# EAGLE schematic detector04 (EAGLE 6.1)
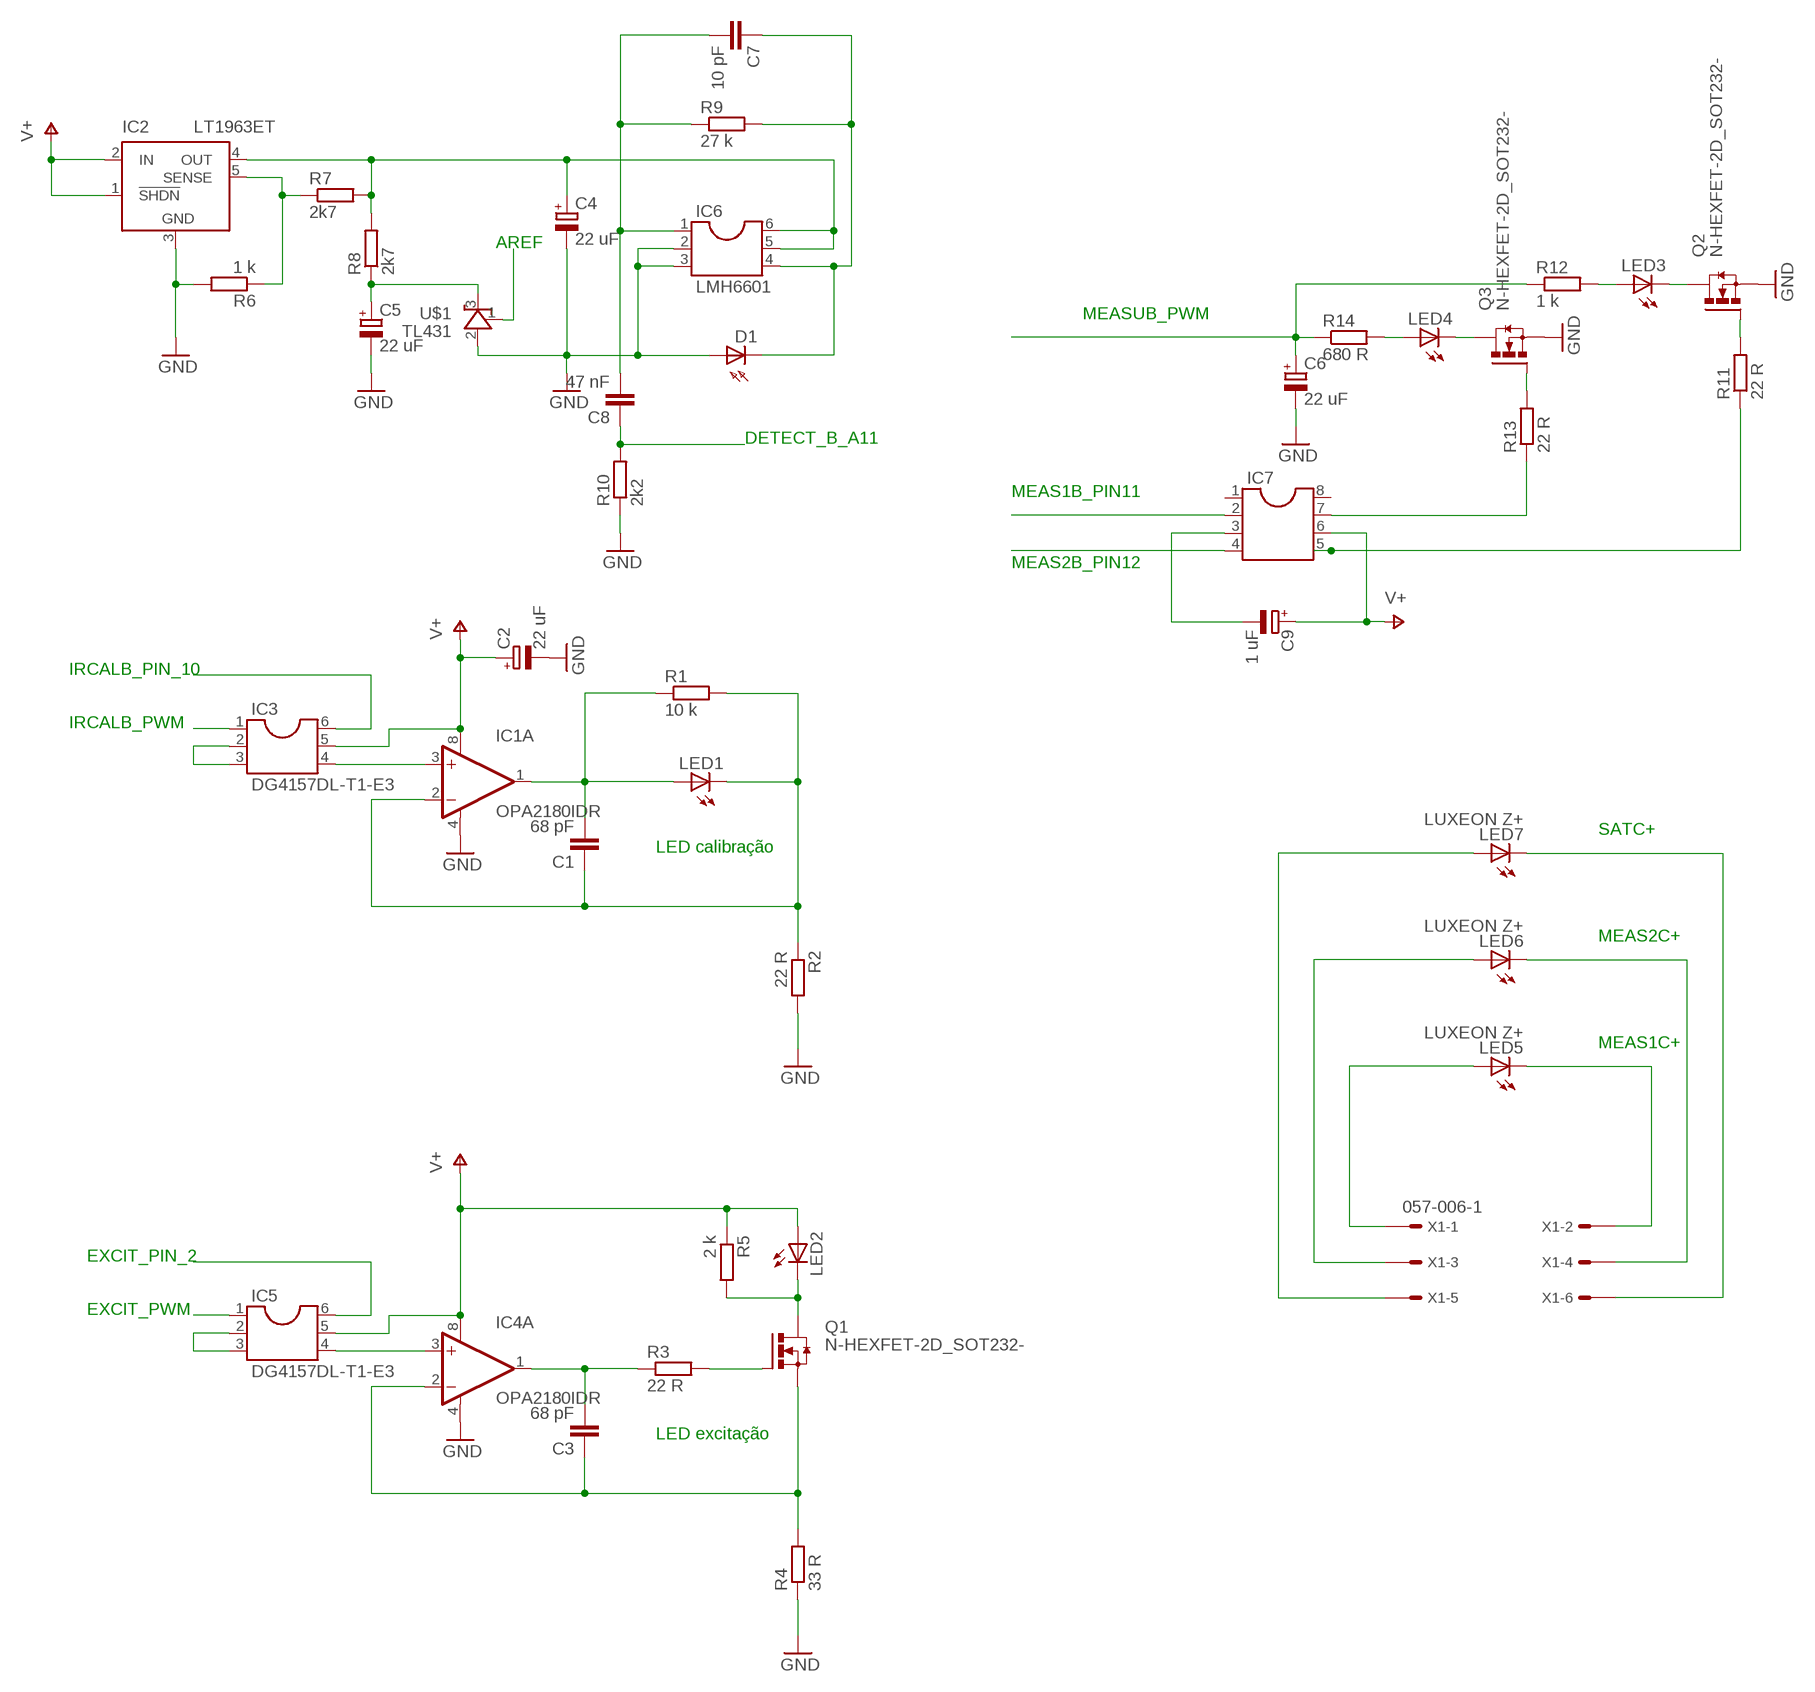
[diagram p0: schematic, sheet 1]

## Parts
C1  68 pF  C-EU025-040X050  [C025-040X050]
C2  22 uF  CPOL-EUE2.5-5  [E2,5-5]
C3  68 pF  C-EU025-040X050  [C025-040X050]
C4  22 uF  CPOL-EUE2.5-5  [E2,5-5]
C5  22 uF  CPOL-EUE2.5-5  [E2,5-5]
C6  22 uF  CPOL-EUE2.5-5  [E2,5-5]
C7  10 pF  C-EU025-040X050  [C025-040X050]
C8  47 nF  C-EU025-040X050  [C025-040X050]
C9  1 uF  CPOL-EUE2.5-5  [E2,5-5]
D1  BPW32  [BPW32]
IC1  OPA2180IDR  OPA2132P  [DIL08]
IC2  LT1963ET  [TO220-5]
IC3  DG4157DL-T1-E3  DIL6  [DIL06]
IC4  OPA2180IDR  OPA2132P  [DIL08]
IC5  DG4157DL-T1-E3  DIL6  [DIL06]
IC6  LMH6601  DIL6  [DIL06]
IC7  DIL8  [DIL08]
LED1  LED5MM  [LED5MM]
LED2  LED5MM  [LED5MM]
LED3  LED5MM  [LED5MM]
LED4  LED5MM  [LED5MM]
LED5  LUXEON Z+  LED5MM  [LED5MM]
LED6  LUXEON Z+  LED5MM  [LED5MM]
LED7  LUXEON Z+  LED5MM  [LED5MM]
Q1  N-HEXFET-2D_SOT232-  [SOT223]
Q2  N-HEXFET-2D_SOT232-  [SOT223]
Q3  N-HEXFET-2D_SOT232-  [SOT223]
R1  10 k  R-EU_0207/7  [0207/7]
R2  22 R  R-EU_0207/7  [0207/7]
R3  22 R  R-EU_0207/7  [0207/7]
R4  33 R  R-EU_0207/7  [0207/7]
R5  2 k  R-EU_0207/7  [0207/7]
R6  1 k  R-EU_0207/7  [0207/7]
R7  2k7  R-EU_0207/7  [0207/7]
R8  2k7  R-EU_0207/7  [0207/7]
R9  27 k  R-EU_0207/7  [0207/7]
R10  2k2  R-EU_0207/7  [0207/7]
R11  22 R  R-EU_0207/7  [0207/7]
R12  1 k  R-EU_0207/7  [0207/7]
R13  22 R  R-EU_0207/7  [0207/7]
R14  680 R  R-EU_0207/7  [0207/7]
U$1  TL431  [TO-92]
X1  057-006-1  [057-006-1]

## Nets
GND: C2.- C4.- C5.- C6.- D1.A IC1.4(A:V-) IC2.3(GND) IC4.4(A:V-) IC6.2 IC6.3 Q2.3(S) Q3.3(S) R2.2 R4.1 R6.2 R10.1 U$1.2(A)
N$1: C1.1 IC1.2(A:-IN) LED1.K(C) R1.2 R2.1
N$2: C1.2 IC1.1(A:OUT) LED1.A R1.1
N$3: IC1.3(A:+IN) IC3.4
N$4: IC3.2 IC3.3
N$5: C3.1 IC4.2(A:-IN) Q1.3(S) R4.2
N$6: IC3.1
N$7: IC3.6
N$8: C3.2 IC4.1(A:OUT) R3.1
N$9: IC4.3(A:+IN) IC5.4
N$10: IC5.2 IC5.3
N$11: IC5.1
N$12: IC5.6
N$13: Q1.1(G) R3.2
N$14: LED2.K(C) Q1.2(D) Q1.4(D) R5.2
N$15: U$1.1(REF)
N$16: IC2.5(SENSE)
N$17: C7.1 D1.K(C) IC6.4 R9.2
N$18: C5.+ R8.1 U$1.3(C)
N$19: R6.1 R7.1
N$20: C7.2 C8.2 IC6.1 R9.1
N$21: C4.+ IC2.4(OUT) IC6.5 IC6.6 R7.2 R8.2
N$22: Q3.1(G) R13.2
N$23: C8.1 R10.2
N$24: Q2.1(G) R11.2
N$25: LED3.K(C) Q2.2(D) Q2.4(D)
N$26: LED3.A R12.2
N$27: LED4.K(C) Q3.2(D) Q3.4(D)
N$28: LED4.A R14.2
N$29: IC7.7 R13.1
N$30: IC7.5 R11.1
N$31: C6.+ R12.1 R14.1
N$32: C9.- IC7.3
N$33: IC7.2
N$34: IC7.4
N$35: LED5.A X1.1
N$36: LED5.K(C) X1.2
N$37: LED6.A X1.3
N$38: LED6.K(C) X1.4
N$39: LED7.A X1.5
N$40: LED7.K(C) X1.6
V+: C2.+ C9.+ IC1.8(A:V+) IC2.1(!SHDN) IC2.2(IN) IC3.5 IC4.8(A:V+) IC5.5 IC7.6 LED2.A R5.1
Unconnected: IC1.5(B:+IN) IC1.6(B:-IN) IC1.7(B:OUT) IC4.5(B:+IN) IC4.6(B:-IN) IC4.7(B:OUT) IC7.1 IC7.8

## Notes on the sheet
- AREF
- MEASUB_PWM
- DETECT_B_A11
- MEAS1B_PIN11
- MEAS2B_PIN12
- IRCALB_PIN_10
- IRCALB_PWM
- SATC+
- LED calibração
- MEAS2C+
- MEAS1C+
- EXCIT_PIN_2
- EXCIT_PWM
- LED excitação

## Library data of the parts
C1 C3 C7 C8 = rcl:C-EU: CAPACITOR, European symbol
C2 C4-C6 C9 = rcl:CPOL-EU: POLARIZED CAPACITOR, European symbol
D1 = opto-trans-siemens:BPW32: PHOTO DIODE; OC_FARNELL: unknown; OC_NEWARK: unknown
IC1 IC4 = burr-brown:OPA2132: High Speed FET-Input Operational Amplifiers< Product Folder:OPA2132; MPN: OPA2132P; OC_FARNELL: 1212432; OC_NEWARK: 47P7461
IC2 = linear-technology:LT1963E: 1.5A, Low Noise, Fast Transient Response LDO Regulator Source: http://www.linear.com/pc/downloadDocument.do?navId=H0,C3,P2222,D3148; MPN: LT1963ET; OC_FARNELL: unknown; OC_NEWARK: 57M7570
IC3 IC5 IC6 = ic-package:DIL6: Dual In Line / Socket
IC7 = ic-package:DIL8: Dual In Line / Socket
LED1-LED7 = led:LED: LED OSRAM: - CHIPLED LG R971, LG N971, LY N971, LG Q971, LY Q971, LO R971, LY R971 LH N974, LH R974 LS Q976, LO Q976, LY Q976 LO Q996 - Hyper CHIPLED LW Q18S LB Q993, LB Q99A, LB R99A - SideLED LS A670, LO A670, LY A670, LG A670, LP A670 LB A673, LV A673, LT A673, LW A673 LH A674 LY A675 LS A676, LA A676, LO A676, LY A676, LW A676 LS A679, LY A679, LG A679 - Hyper Micro SIDELED® LS Y876, LA Y876, LO Y876, LY Y876 LT Y87S - SmartLED LW L88C, LW L88S LB L89C, LB L89S, LG L890 LS L89K, LO L89K, LY L89K LS L896, LA L896, LO L896, LY L896 - TOPLED LS T670, LO T670, LY T670, LG T670, LP T670 LSG T670, LSP T670, LSY T670, LOP T670, LYG T670 LG T671, LOG T671, LSG T671 LB T673, LV T673, LT T673, LW T673 LH T674 LS T676, LA T676, LO T676, LY T676, LB T676, LH T676, LSB T676, LW T676 LB T67C, LV T67C, LT T67C, LS T67K, LO T67K, LY T67K, LW E67C LS E67B, LA E67B, LO E67B, LY E67B, LB E67C, LV E67C, LT E67C LW T67C LS T679, LY T679, LG T679 LS T770, LO T770, LY T770, LG T770, LP T770 LB T773, LV T773, LT T773, LW T773 LH T774 LS E675, LA E675, LY E675, LS T675 LS T776, LA T776, LO T776, LY T776, LB T776 LHGB T686 LT T68C, LB T68C - Hyper Mini TOPLED® LB M676 - Mini TOPLED Santana® LG M470 LS M47K, LO M47K, LY M47K Source: http://www.osram.convergy.de LUXEON: - LUMILED® LXK2-PW12-R00, LXK2-PW12-S00, LXK2-PW14-U00, LXK2-PW14-V00 LXK2-PM12-R00, LXK2-PM12-S00, LXK2-PM14-U00 LXK2-PE12-Q00, LXK2-PE12-R00, LXK2-PE12-S00, LXK2-PE14-T00, LXK2-PE14-U00 LXK2-PB12-K00, LXK2-PB12-L00, LXK2-PB12-M00, LXK2-PB14-N00, LXK2-PB14-P00, LXK2-PB14-Q00 LXK2-PR12-L00, LXK2-PR12-M00, LXK2-PR14-Q00, LXK2-PR14-R00 LXK2-PD12-Q00, LXK2-PD12-R00, LXK2-PD12-S00 LXK2-PH12-R00, LXK2-PH12-S00 LXK2-PL12-P00, LXK2-PL12-Q00, LXK2-PL12-R00 Source: www.luxeon.com KINGBRIGHT: KA-3528ASYC Source: www.kingbright.com
Q1-Q3 = transistor-power:N-HEXFET-2D_?-*: HEXFET® Power MOSFET 2 Drain connects http://www.irf.com/product-info/datasheets/data/irll014n.pdf
R1-R14 = rcl:R-EU_: RESISTOR, European symbol
U$1 = GuShH:TL431
X1 = con-panduit:057-006-: CONNECTOR 6-pin series 057 contact pc board low profile headers; OC_FARNELL: unknown; OC_NEWARK: unknown